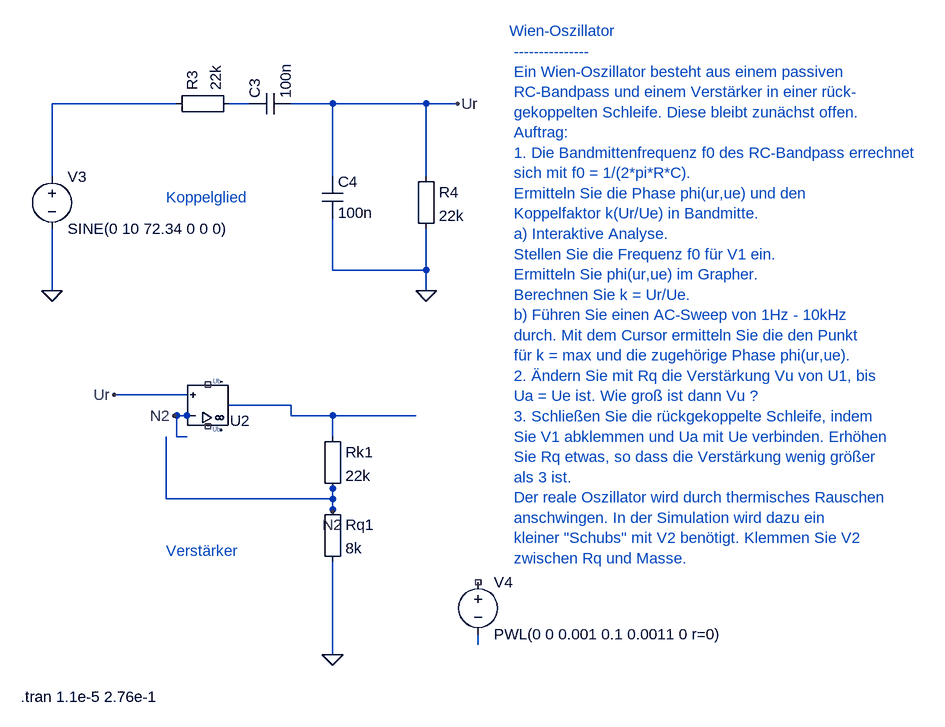
[diagram p0: schematic 9_4_1_Wien_Oszillator_1.asc]
9_4_1_Wien_Oszillator_1.asc, the LTspice schematic file:
Version 4
SHEET 1 880 680
WIRE 480 160 496 160
WIRE 112 352 112 368
WIRE 544 336 544 352
WIRE 320 640 304 640
WIRE 304 640 304 672
WIRE 304 672 320 672
WIRE 384 624 480 624
WIRE 480 624 480 640
WIRE 768 976 768 992
WIRE 416 160 384 160
WIRE 688 448 688 416
WIRE 688 352 688 416
WIRE 496 160 544 160
WIRE 112 368 112 448
WIRE 544 272 544 160
WIRE 688 272 688 160
WIRE 688 416 544 416
WIRE 544 416 544 352
WIRE 688 160 544 160
WIRE 736 160 688 160
WIRE 480 640 544 640
WIRE 544 752 544 768
WIRE 544 768 544 784
WIRE 288 672 288 768
WIRE 288 768 544 768
WIRE 544 640 544 672
WIRE 208 608 320 608
WIRE 672 640 544 640
WIRE 304 160 112 160
WIRE 112 160 112 272
WIRE 544 1008 544 864
WIRE 544 752 544 788
WIRE 320 640 300 640
FLAG 688 448 0
FLAG 112 448 0
FLAG 544 1008 0
FLAG 688 448 0
FLAG 112 448 0
FLAG 544 1008 0
FLAG 544 788 N2
FLAG 300 640 N2
FLAG 736 160 Ur
FLAG 208 608 Ur
SYMBOL Misc\EuropeanResistor 288 176 R270
SYMATTR InstName R3
SYMATTR Value 22k
SYMBOL cap 416 176 R270
SYMATTR InstName C3
SYMATTR Value 100n
SYMBOL voltage 112 256 R0
SYMATTR InstName V3
SYMATTR Value SINE(0 10 72.34 0 0 0)
SYMBOL Misc\EuropeanResistor 672 256 R0
SYMATTR InstName R4
SYMATTR Value 22k
SYMBOL cap 528 272 R0
SYMATTR InstName C4
SYMATTR Value 100n
SYMBOL UniversalOpAmp2 352 624 M180
SYMATTR InstName U2
SYMATTR Value UniversalOpAmp2
SYMBOL Misc\EuropeanResistor 528 656 R0
SYMATTR InstName Rk1
SYMATTR Value 22k
SYMBOL Misc\EuropeanResistor 528 768 R0
SYMATTR InstName Rq1
SYMATTR Value 8k
SYMBOL voltage 768 880 R0
SYMATTR InstName V4
SYMATTR Value PWL(0 0 0.001 0.1 0.0011 0 r=0)
TEXT 64 1072 Left 2 !.tran 1.1e-5 2.76e-1
TEXT 816 48 Left 2 ;Wien-Oszillator \n --------------- \n Ein Wien-Oszillator besteht aus einem passiven \n RC-Bandpass und einem Verstärker in einer rück- \n gekoppelten Schleife. Diese bleibt zunächst offen. \n Auftrag: \n 1. Die Bandmittenfrequenz f0 des RC-Bandpass errechnet \n sich mit f0 = 1/(2*pi*R*C). \n Ermitteln Sie die Phase phi(ur,ue) und den \n Koppelfaktor k(Ur/Ue) in Bandmitte. \n a) Interaktive Analyse. \n Stellen Sie die Frequenz f0 für V1 ein. \n Ermitteln Sie phi(ur,ue) im Grapher. \n Berechnen Sie k = Ur/Ue. \n b) Führen Sie einen AC-Sweep von 1Hz - 10kHz \n durch. Mit dem Cursor ermitteln Sie die den Punkt \n für k = max und die zugehörige Phase phi(ur,ue). \n 2. Ändern Sie mit Rq die Verstärkung Vu von U1, bis \n Ua = Ue ist. Wie groß ist dann Vu ? \n 3. Schließen Sie die rückgekoppelte Schleife, indem \n Sie V1 abklemmen und Ua mit Ue verbinden. Erhöhen \n Sie Rq etwas, so dass die Verstärkung wenig größer \n als 3 ist. \n Der reale Oszillator wird durch thermisches Rauschen \n anschwingen. In der Simulation wird dazu ein \n kleiner "Schubs" mit V2 benötigt. Klemmen Sie V2 \n zwischen Rq und Masse.
TEXT 288 304 Left 2 ;Koppelglied
TEXT 288 848 Left 2 ;Verstärker

The netlist it stands for:
* 9_4_1_Wien_Oszillator_1.asc
R3 N004 N003 22k
C3 N003 Ur 100n
V3 N004 0 SINE(0 10 72.34 0 0 0)
R4 Ur 0 22k
C4 Ur 0 100n
XU2 Ur N2 NC_01 NC_02 N001 level2 UniversalOpAmp2 Avol=1Meg GBW=10Meg Slew=10Meg Ilimit=25m Rail=0 Vos=0 En=0 Enk=0 In=0 Ink=0 Rin=500Meg  ; pins In+ In- V+ V- OUT
Rk1 N001 N2 22k
Rq1 N2 0 8k
V4 NC_03 N002 PWL(0 0 0.001 0.1 0.0011 0 r=0)
.tran 1.1e-5 2.76e-1
* Wien-Oszillator
*  ---------------
*  Ein Wien-Oszillator besteht aus einem passiven
*  RC-Bandpass und einem Verstärker in einer rück-
*  gekoppelten Schleife. Diese bleibt zunächst offen.
*  Auftrag:
*  1. Die Bandmittenfrequenz f0 des RC-Bandpass errechnet
*  sich mit f0 = 1/(2*pi*R*C).
*  Ermitteln Sie die Phase phi(ur,ue) und den
*  Koppelfaktor k(Ur/Ue) in Bandmitte.
*  a) Interaktive Analyse.
*  Stellen Sie die Frequenz f0 für V1 ein.
*  Ermitteln Sie phi(ur,ue) im Grapher.
*  Berechnen Sie k = Ur/Ue.
*  b) Führen Sie einen AC-Sweep von 1Hz - 10kHz
*  durch. Mit dem Cursor ermitteln Sie die den Punkt
*  für k = max und die zugehörige Phase phi(ur,ue).
*  2. Ändern Sie mit Rq die Verstärkung Vu von U1, bis
*  Ua = Ue ist. Wie groß ist dann Vu ?
*  3. Schließen Sie die rückgekoppelte Schleife, indem
*  Sie V1 abklemmen und Ua mit Ue verbinden. Erhöhen
*  Sie Rq etwas, so dass die Verstärkung wenig größer
*  als 3 ist.
*  Der reale Oszillator wird durch thermisches Rauschen
*  anschwingen. In der Simulation wird dazu ein
*  kleiner "Schubs" mit V2 benötigt. Klemmen Sie V2
*  zwischen Rq und Masse.
* Koppelglied
* Verstärker
.lib UniversalOpAmp2.lib
.backanno
.end